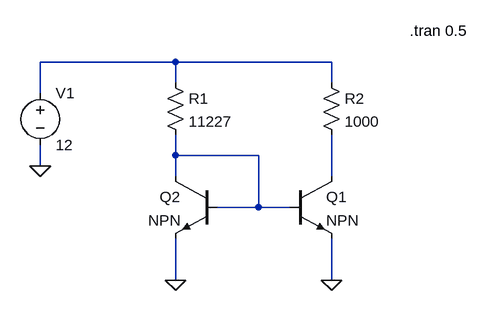
[diagram p0: schematic Draft4.asc]
Draft4.asc, the LTspice schematic file:
Version 4
SHEET 1 880 680
WIRE 336 192 128 192
WIRE 576 192 336 192
WIRE 336 224 336 192
WIRE 576 224 576 192
WIRE 128 240 128 192
WIRE 336 336 336 304
WIRE 464 336 336 336
WIRE 128 352 128 320
WIRE 336 368 336 336
WIRE 576 368 576 304
WIRE 464 416 464 336
WIRE 464 416 400 416
WIRE 512 416 464 416
WIRE 336 528 336 464
WIRE 576 528 576 464
FLAG 336 528 0
FLAG 128 352 0
FLAG 576 528 0
SYMBOL npn 512 368 R0
SYMATTR InstName Q1
SYMBOL npn 400 368 M0
SYMATTR InstName Q2
SYMBOL res 320 208 R0
SYMATTR InstName R1
SYMATTR Value 11227
SYMBOL voltage 128 224 R0
SYMATTR InstName V1
SYMATTR Value 12
SYMBOL Res 560 208 R0
SYMATTR InstName R2
SYMATTR Value 1000
TEXT 696 144 Left 2 !.tran 0.5

The netlist it stands for:
* Draft4.asc
Q1 N003 N002 0 0 NPN
Q2 N002 N002 0 0 NPN
R1 N001 N002 11227
V1 N001 0 12
R2 N001 N003 1000
.model NPN NPN
.model PNP PNP
.lib standard.bjt
.tran 0.5
.backanno
.end